# EAGLE schematic GWLSensor_v10 (EAGLE 9.5.2)
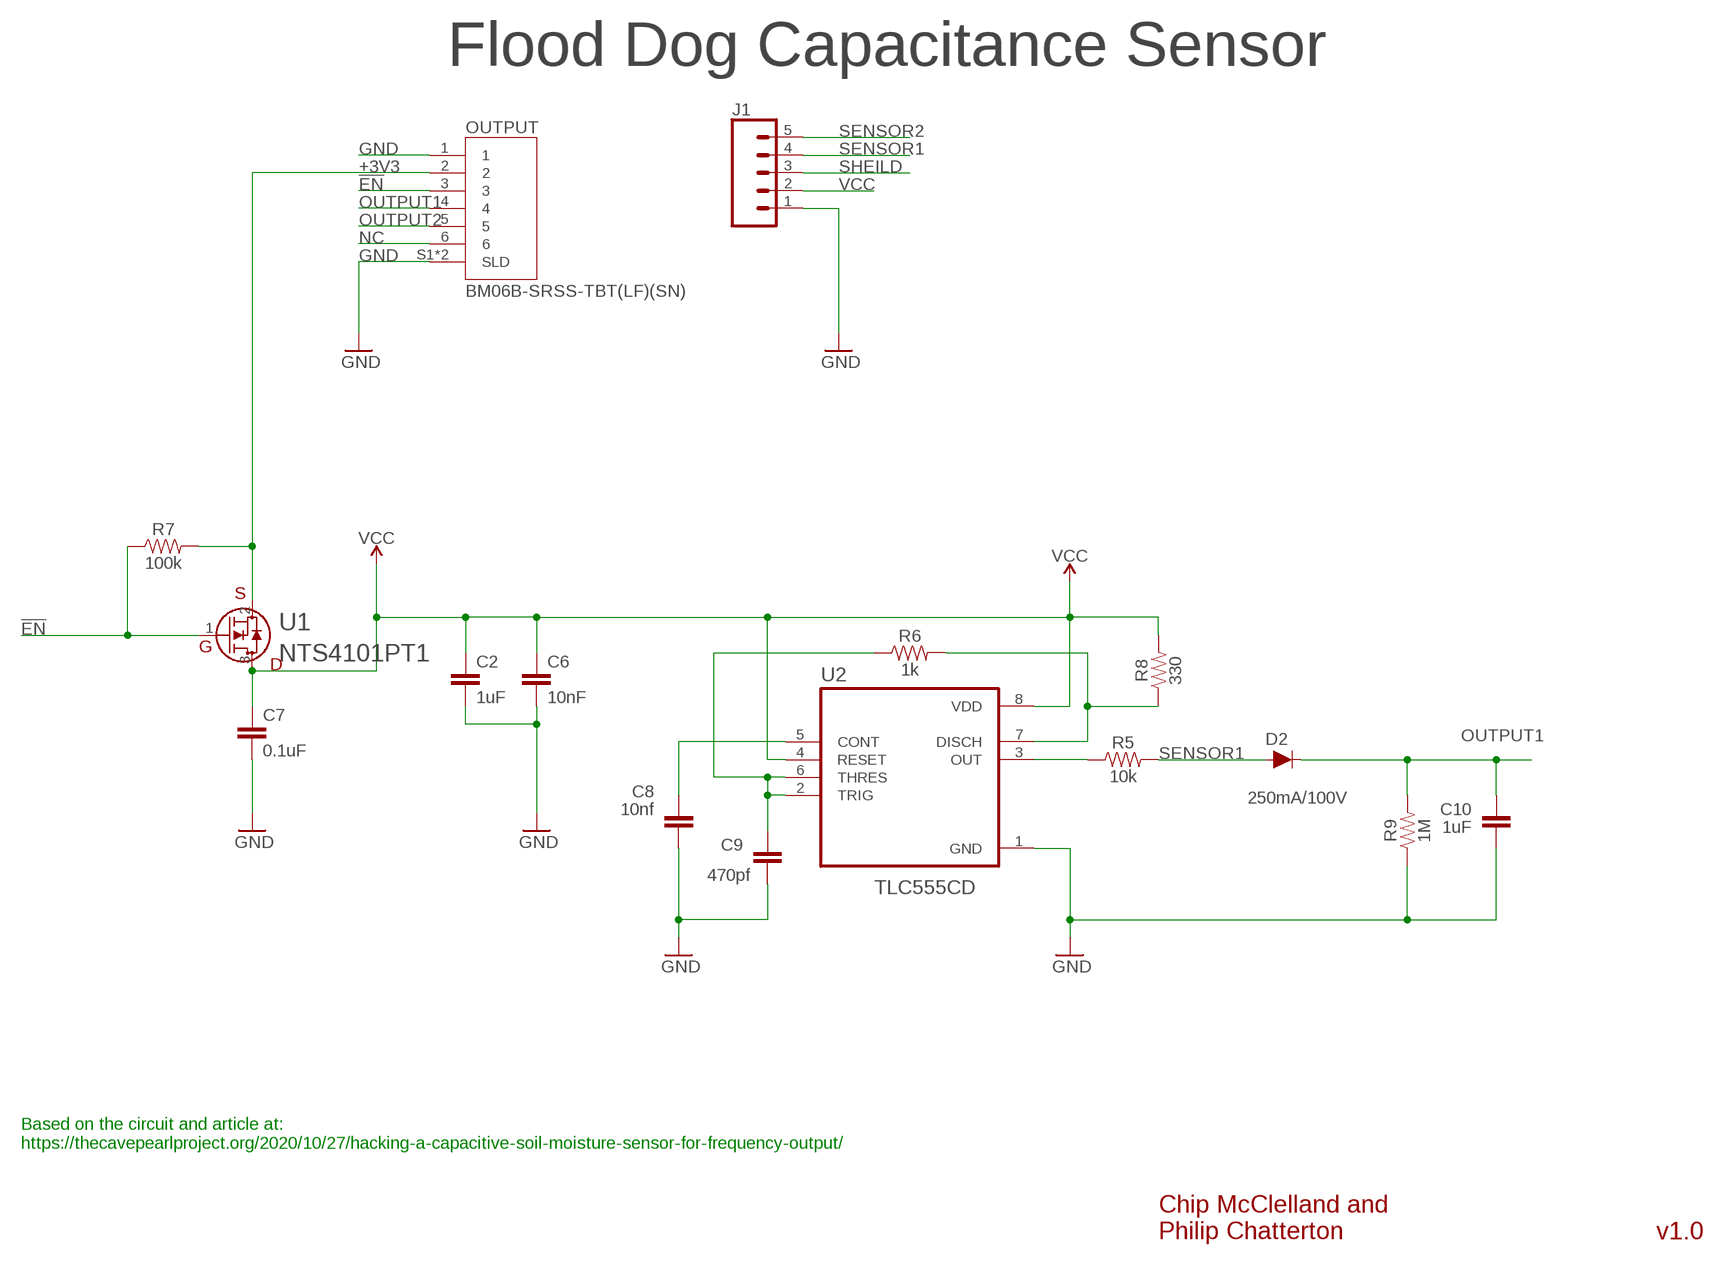
[diagram p0: schematic, sheet 1]

## Parts
C2  1uF  CAP-MF-1UF-0805  [0805@1]
C6  10nF  CAP-10NF-0805  [0805@1]
C7  0.1uF  CAP-MF-0.1UF-0805  [0805@1]
C8  10nf  C-EUC0805  [C0805]
C9  470pf  C-EUC0805  [C0805]
C10  1uF  C-EUC0805  [C0805]
D2  250mA/100V  DIODE-BAS16J  [SOD-323]
J1  CONN_05SCREW  [SCREWTERMINAL-3.5MM-5]
OUTPUT  BM06B-SRSS-TBT(LF)(SN)  [JST_BM06B-SRSS-TB(LF)(SN)]
R5  10k  RESISTOR-MF-10K-0805  [0805]
R6  1k  RESISTOR-MF-1K-0805  [0805]
R7  100k  RESISTOR-MF-100K-0805  [0805]
R8  330  RESISTOR-MF-330-0805  [0805]
R9  1M  RESISTOR-MF-1K-0805  [0805]
U1  NTS4101PT1  [SOT_101PT1_ONS]
U2  TLC555CD  [SOIC127P599X175-8N]

## Nets
!EN: OUTPUT.3 R7.1 U1.1(G)
+3V3: OUTPUT.2 R7.2 U1.2(S)
GND: C2.2 C6.2 C7.2 C8.1 C9.1 C10.1 J1.1 OUTPUT.1 OUTPUT.S1(SLD) OUTPUT.S2(SLD) R9.1 U2.1(GND)
N$1: C8.2 U2.5(CONT)
N$5: R5.1 U2.3(OUT)
N$8: C9.2 R6.1 U2.2(TRIG) U2.6(THRES)
N$9: R6.2 R8.1 U2.7(DISCH)
NC: OUTPUT.6
OUTPUT1: C10.2 D2.C OUTPUT.4 R9.2
OUTPUT2: OUTPUT.5
SENSOR1: D2.A J1.4 R5.2
SENSOR2: J1.5
SHEILD: J1.3
VCC: C2.1 C6.1 C7.1 J1.2 R8.2 U1.3(D) U2.4(RESET) U2.8(VDD)

## Notes on the sheet
- Flood Dog Capacitance Sensor
- Based on the circuit and article at:
  https://thecavepearlproject.org/2020/10/27/hacking-a-capacitive-soil-moisture-sensor-for-frequency-output/
- Chip McClelland and
  Philip Chatterton
- v1.0

## Library data of the parts
C2 = Custom Components:CAP-MF-1UF-: Capacitor Macrofab House Part (https://factory.macrofab.com/parts). Standard ceramic capacitor, and 0.1" leaded capacitor.; HOUSEPART: yes; MPN: MF-CAP-0805-1uF; POPULATE: 1; URL: https://factory.macrofab.com/part/MF-CAP-0805-1uF
C6 = Custom Components:CAP-10NF-: Capacitor 10nF variant Standard 0805 ceramic capacitor; DIGIKEY: 399-C0805X103K1RAC3316CT-ND; HOUSEPART: NO; MPN: C0805X103K1RAC3316; POPULATE: 1; URL: https://www.digikey.com/en/products/detail/kemet/C0805X103K1RAC3316/10315780
C7 = Custom Components:CAP-MF-0.1UF-: Capacitor Macrofab House Part (https://factory.macrofab.com/parts). Standard ceramic capacitor, and 0.1" leaded capacitor.; HOUSEPART: YES; MPN: MF-CAP-0805-0.1uF; POPULATE: 1; URL: https://factory.macrofab.com/part/MF-CAP-0805-0.1uF
C8-C10 = rcl:C-EU: CAPACITOR, European symbol
D2 = Custom Components:DIODE: Diode These are standard reverse protection diodes and small signal diodes. SparkFun Products: SparkFun SparkPunk Sound Kit <https://www.sparkfun.com/products/11177> SparkFun ESP8266 Thing <https://www.sparkfun.com/products/13231>; MPN: BAS16HT1G
J1 = SparkFun-Connectors:CONN_05: Multi connection point. Often used as Generic Header-pin footprint for 0.1 inch spaced/style header connections On any of the 0.1 inch spaced packages, you can populate with these: Break Away Headers - Straight <https://www.sparkfun.com/products/116> (PRT-00116) Break Away Male Headers - Right Angle <https://www.sparkfun.com/products/553> (PRT-00553) Female Headers <https://www.sparkfun.com/products/115> (PRT-00115) Break Away Headers - Machine Pin <https://www.sparkfun.com/products/117> (PRT-00117) Break Away Female Headers - Swiss Machine Pin <https://www.sparkfun.com/products/743> (PRT-00743) For SCREWTERMINALS and SPRING TERMINALS visit here: Screw Terimnals on SparkFun.com <https://www.sparkfun.com/search/results?term=Screw+Terminals> (5mm/3.5mm/2.54mm spacing) This device is also useful as a general connection point to wire up your design to another part of your project. Our various solder wires solder well into these plated through hole pads. Hook-Up Wire - Assortment (Stranded, 22 AWG) <https://www.sparkfun.com/products/11375> (PRT-11375) Hook-Up Wire - Assortment (Solid Core, 22 AWG) <https://www.sparkfun.com/products/11367> (PRT-11367) View the entire wire category on our website here <https://www.sparkfun.com/categories/141> Special notes: Molex polarized connector foot print use with SKU : PRT-08231 with associated crimp pins and housings. 1MM SMD Version SKU: PRT-10208; PROD_ID: Combine 8288+8399
OUTPUT = Custom Components:BM06B-SRSS-TBT(LF)(SN): 6 Position 1.0mm Top-Entry Surface Mount Shrouded Header; MPN: BM06B-SRSS-TBT(LF)(SN); POPULATE: 1
R5 = Custom Components:RESISTOR-MF-10K-: Generic 0805 Resistor Package; MPN: MF-RES-0805-10K; POPULATE: 1; URL: https://factory.macrofab.com/part/MF-RES-0805-10K
R6 = Custom Components:RESISTOR-MF-1K-: Generic 0805 Resistor Package; HOUSEPART: YES; MPN: MF-RES-0805-1K; POPULATE: 1; URL: https://factory.macrofab.com/part/MF-RES-0805-1k
R7 = Custom Components:RESISTOR-MF-100K-: Generic 0805 Resistor Package; MPN: MF-RES-0805-100K; POPULATE: 1; URL: https://factory.macrofab.com/part/MF-RES-0805-100K
R8 = Custom Components:RESISTOR-MF-330-: Generic 0805 Resistor Package; HOUSEPART: YES; MPN: MF-RES-0805-330; POPULATE: 1
R9 = Custom Components:RESISTOR-MF-1K-: Generic 0805 Resistor Package; HOUSEPART: YES; MPN: MF-RES-0805-1K; POPULATE: 1; URL: https://factory.macrofab.com/part/MF-RES-0805-1k; VALUE: 1k
U1 = Custom Components:NTS4101PT1; DATASHEET: https://datasheet.octopart.com/NTS4101PT1-ON-Semiconductor-datasheet-139013286.pdf; MANUFACTURER_PART_NUMBER: NTS4101PT1; SOURCELIBRARY: ON_Semiconductor_2020-03-06; VENDOR: ON Semiconductor
U2 = Custom Components:TLC555CD; DESCRIPTION: 2.1-MHz, 250-A, Low-Power Timer 8-SOIC 0 to 70; DIGI-KEY_PART_NUMBER: 296-52992-ND; MF: Texas Instruments; MP: TLC555CD; PACKAGE: SOIC-8 Texas Instruments; PURCHASE-URL: https://pricing.snapeda.com/search/part/TLC555CD/?ref=eda